# Altium schematic sheet 模型主控V1.SchDoc
size A1
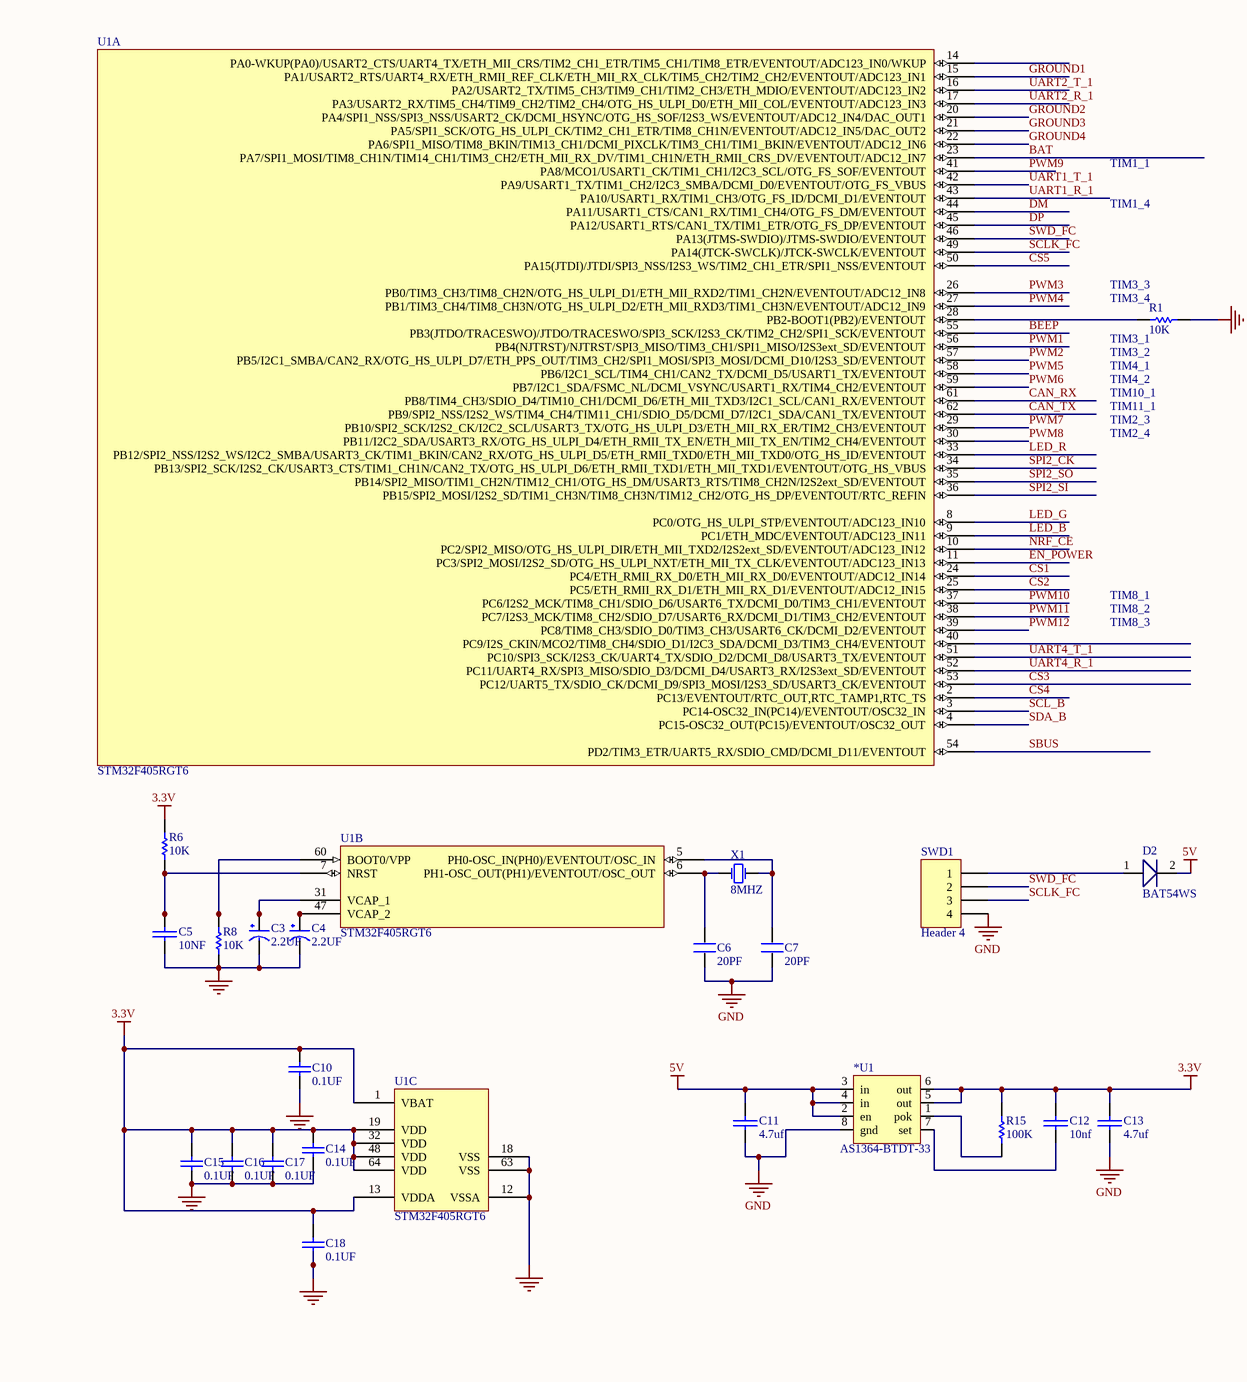
[diagram p0: 模型主控V1.SchDoc, top left]
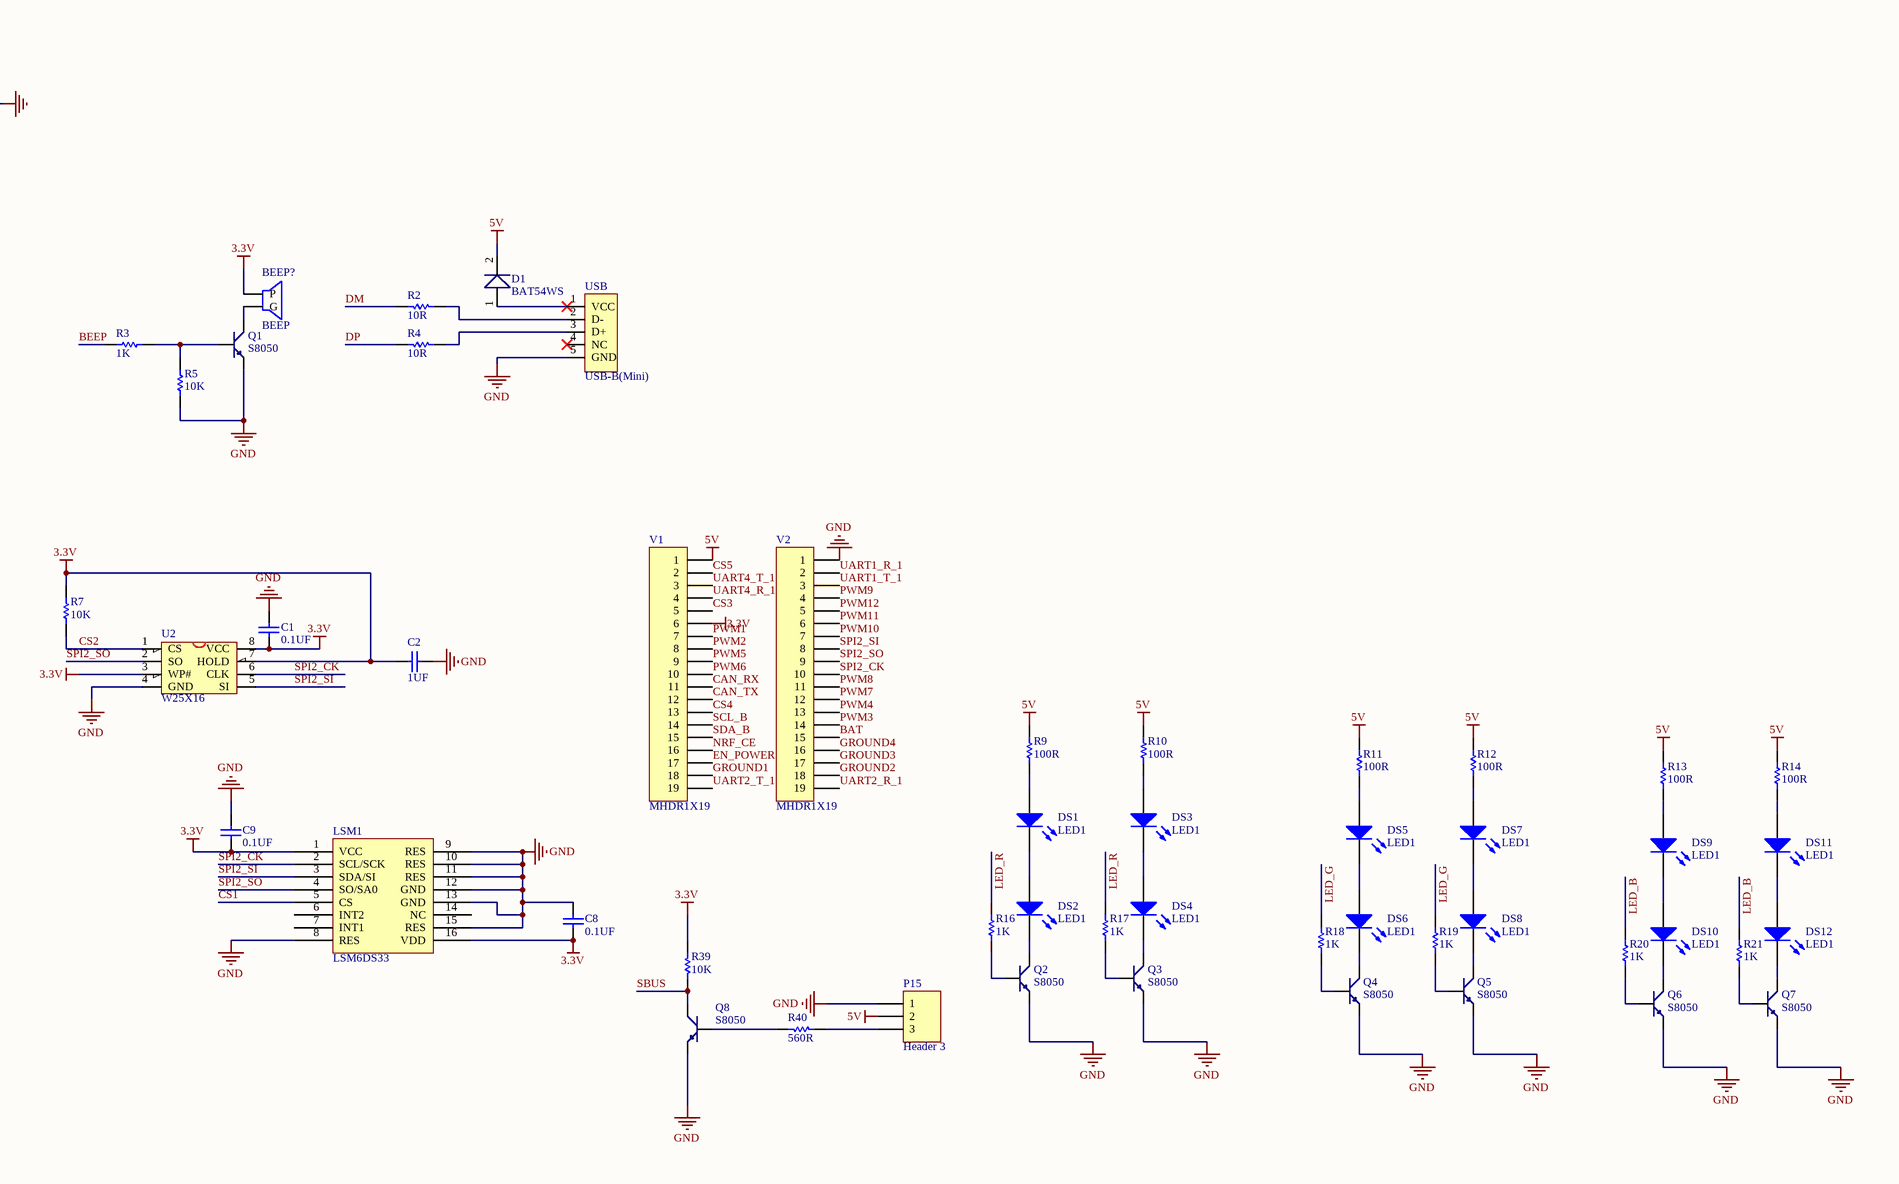
[diagram p1: 模型主控V1.SchDoc, top right]
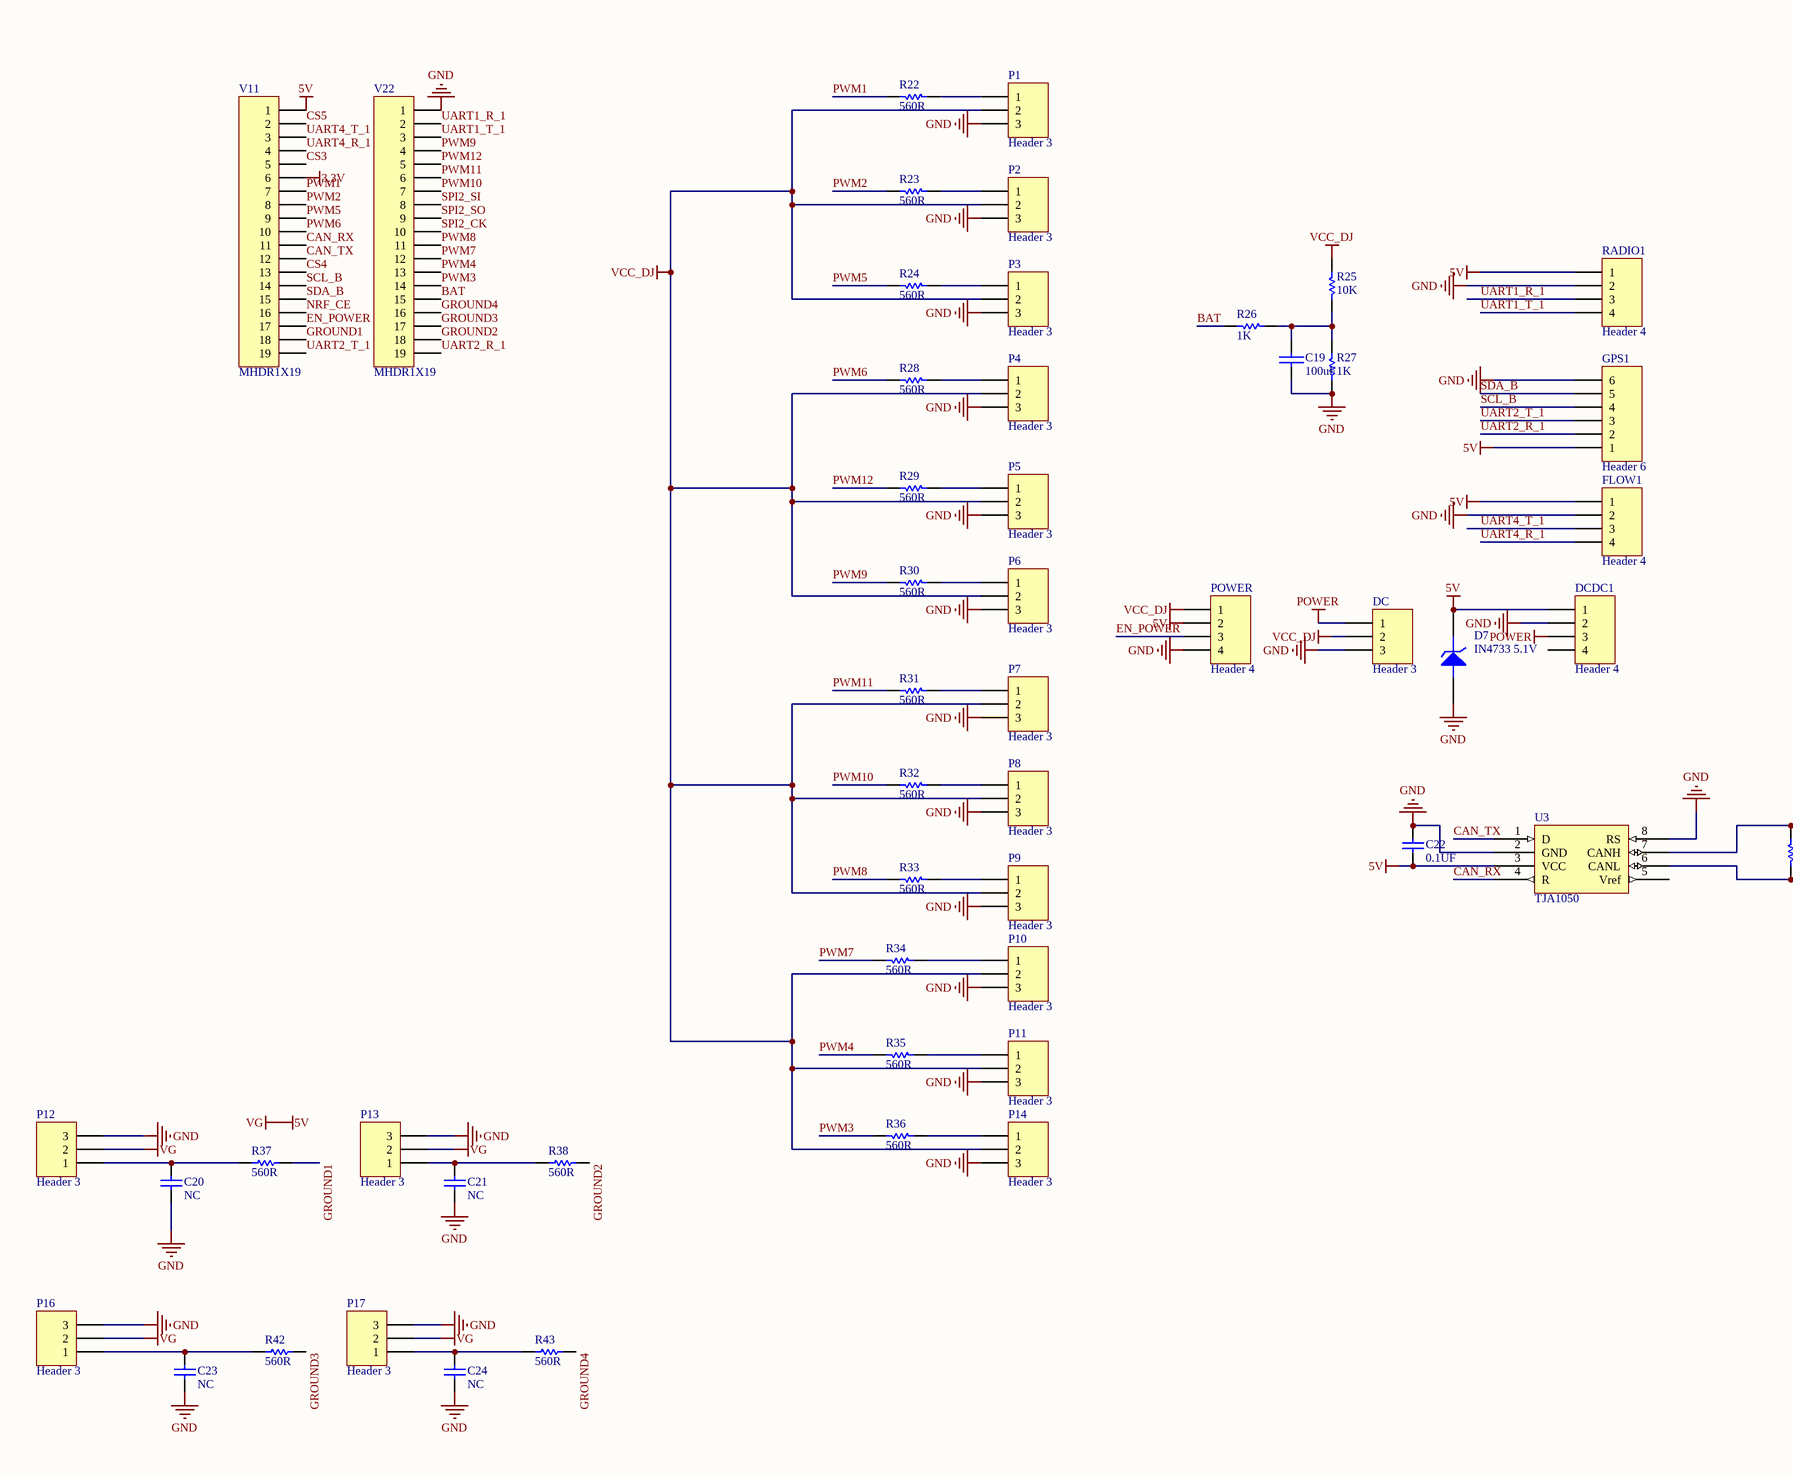
[diagram p2: 模型主控V1.SchDoc, bottom left]
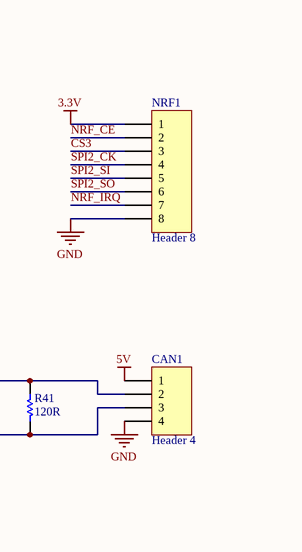
[diagram p3: 模型主控V1.SchDoc, bottom right]

## Parts
*U1  AS1364-BTDT-33  [TDFN-8]
BEEP?  BEEP  [DET402]
C1  0.1UF  [C 0402]
C2  1UF  [C 0402]
C3  2.2UF  [C0603]
C4  2.2UF  [C0603]
C5  10NF  [C 0402]
C6  20PF  [C 0402]
C7  20PF  [C 0402]
C8  0.1UF  [C0603]
C9  0.1UF  [C0603]
C10  0.1UF  [C 0402]
C11  4.7uf  [C0603]
C12  10nf  [C0603]
C13  4.7uf  [C0603]
C14  0.1UF  [C 0402]
C15  0.1UF  [C 0402]
C16  0.1UF  [C 0402]
C17  0.1UF  [C 0402]
C18  0.1UF  [C 0402]
C19  100uF  [C0603]
C20  NC  [C0603]
C21  NC  [C0603]
C22  0.1UF  [C 0402]
C23  NC  [C0603]
C24  NC  [C0603]
CAN1  Header 4  [PH2.0-4]
D1  BAT54WS  [SOD-323]
D2  BAT54WS  [SOD-323]
D7  IN4733 5.1V  [1n4148-SOD123]
DC  Header 3  [HDR1X3]
DCDC1  Header 4  [HDR1X4]
DS1  LED1  [0603_LED]
DS2  LED1  [0603_LED]
DS3  LED1  [0603_LED]
DS4  LED1  [0603_LED]
DS5  LED1  [0603_LED]
DS6  LED1  [0603_LED]
DS7  LED1  [0603_LED]
DS8  LED1  [0603_LED]
DS9  LED1  [0603_LED]
DS10  LED1  [0603_LED]
DS11  LED1  [0603_LED]
DS12  LED1  [0603_LED]
FLOW1  Header 4  [JST_GH_V4]
GPS1  Header 6  [JST_GH_V6]
LSM1  LSM6DS33  [LSM6DS33]
NRF1  Header 8  [NRF]
P1  Header 3  [HDR1X3]
P2  Header 3  [HDR1X3]
P3  Header 3  [HDR1X3]
P4  Header 3  [HDR1X3]
P5  Header 3  [HDR1X3]
P6  Header 3  [HDR1X3]
P7  Header 3  [HDR1X3]
P8  Header 3  [HDR1X3]
P9  Header 3  [HDR1X3]
P10  Header 3  [HDR1X3]
P11  Header 3  [HDR1X3]
P12  Header 3  [HDR1X3]
P13  Header 3  [HDR1X3]
P14  Header 3  [HDR1X3]
P15  Header 3  [HDR1X3]
P16  Header 3  [HDR1X3]
P17  Header 3  [HDR1X3]
POWER  Header 4  [JST_GH_V4]
Q1  S8050  [SOT-23R]
Q2  S8050  [SOT-23R]
Q3  S8050  [SOT-23R]
Q4  S8050  [SOT-23R]
Q5  S8050  [SOT-23R]
Q6  S8050  [SOT-23R]
Q7  S8050  [SOT-23R]
Q8  S8050  [SOT-23R]
R1  10K  [R 0402]
R2  10R  [R 0402]
R3  1K  [R0603]
R4  10R  [R 0402]
R5  10K  [R0603]
R6  10K  [R 0402]
R7  10K  [R 0402]
R8  10K  [R 0402]
R9  100R  [R 0402]
R10  100R  [R 0402]
R11  100R  [R 0402]
R12  100R  [R 0402]
R13  100R  [R 0402]
R14  100R  [R 0402]
R15  100K  [R0603]
R16  1K  [R 0402]
R17  1K  [R 0402]
R18  1K  [R 0402]
R19  1K  [R 0402]
R20  1K  [R 0402]
R21  1K  [R 0402]
R22  560R  [R 0402]
R23  560R  [R 0402]
R24  560R  [R 0402]
R25  10K  [R0603]
R26  1K  [R0603]
R27  1K  [R0603]
R28  560R  [R 0402]
R29  560R  [R 0402]
R30  560R  [R 0402]
R31  560R  [R 0402]
R32  560R  [R 0402]
R33  560R  [R 0402]
R34  560R  [R 0402]
R35  560R  [R 0402]
R36  560R  [R 0402]
R37  value 560R  [R0603]  (hidden comment: 1K)
R38  value 560R  [R0603]  (hidden comment: 1K)
R39  10K  [R 0402]
R40  560R  [R 0402]
R41  120R  [R0603]
R42  value 560R  [R0603]  (hidden comment: 1K)
R43  value 560R  [R0603]  (hidden comment: 1K)
RADIO1  Header 4  [JST_GH_V4]
SWD1  Header 4  [SH1.0-4P]
U1  STM32F405RGT6  [LQFP64_M]  (parts A,B,C of 3)
U2  W25X16  [W25Q32FVZPIG]
U3  TJA1050  [SOP-8]
USB  USB-B(Mini)  [Micro_USB]
V1  MHDR1X19  [MHDR1X19]
V2  MHDR1X19  [MHDR1X19]
V11  MHDR1X19  [MHDR1X19]
V22  MHDR1X19  [MHDR1X19]
X1  8MHZ  [PXCL]

## Nets
3.3V: *U1.5(out) *U1.6(out) BEEP?.1(P) C1.1 C2.2 C8.2 C9.2 C10.1 C12.1 C13.1 C14.1 C15.1 C16.1 C17.1 C18.1 LSM1.1(VCC) LSM1.16(VDD) NRF1.1 R6.2 R7.1 R15.1 R39.2 U1.1(VBAT) U1.13(VDDA) U1.19(VDD) U1.32(VDD) U1.48(VDD) U1.64(VDD) U2.3(WP#) U2.7(HOLD) U2.8(VCC) V1.6 V11.6
5V: *U1.2(en) *U1.3(in) *U1.4(in) C11.1 C22.2 CAN1.1 D1.2 D2.2 D7.2(K) DCDC1.1 FLOW1.1 GPS1.1 P12.2 P13.2 P15.2 P16.2 P17.2 POWER.2 R9.1 R10.1 R11.1 R12.1 R13.1 R14.1 RADIO1.1 U3.3(VCC) V1.1 V11.1  [also labelled VG]
GND: *U1.8(gnd) C1.2 C2.1 C3.2(GND) C4.2(GND) C5.1 C6.1 C7.1 C8.1 C9.1 C10.2 C11.2 C13.2 C14.2 C15.2 C16.2 C17.2 C18.2 C19.2 C20.2 C21.2 C22.1 C23.2 C24.2 CAN1.4 D7.1(A) DC.3 DCDC1.2 FLOW1.2 GPS1.6 LSM1.8(RES) LSM1.9(RES) LSM1.10(RES) LSM1.11(RES) LSM1.12(GND) LSM1.13(GND) LSM1.15(RES) NRF1.8 P1.3 P2.3 P3.3 P4.3 P5.3 P6.3 P7.3 P8.3 P9.3 P10.3 P11.3 P12.3 P13.3 P14.3 P15.1 P16.3 P17.3 POWER.4 Q1.1(E) Q2.1(E) Q3.1(E) Q4.1(E) Q5.1(E) Q6.1(E) Q7.1(E) Q8.1(E) R1.1 R5.1 R8.1 R27.1 RADIO1.2 SWD1.4 U1.12(VSSA) U1.18(VSS) U1.63(VSS) U2.4(GND) U3.2(GND) U3.8(RS) USB.5(GND) V2.1 V22.1
POWER: DC.1 DCDC1.3
VCC_DJ: DC.2 P1.2 P2.2 P3.2 P4.2 P5.2 P6.2 P7.2 P8.2 P9.2 P10.2 P11.2 P14.2 POWER.1 R25.2
BAT: R26.1 U1.23(PA7/SPI1_MOSI/TIM8_CH1N/TIM14_CH1/TIM3_CH2/ETH_MII_RX_DV/TIM1_CH1N/ETH_RMII_CRS_DV/EVENTOUT/ADC12_IN7) V2.15 V22.15
BEEP: R3.2 U1.55(PB3(JTDO/TRACESWO)/JTDO/TRACESWO/SPI3_SCK/I2S3_CK/TIM2_CH2/SPI1_SCK/EVENTOUT)
CAN_RX: U1.61(PB8/TIM4_CH3/SDIO_D4/TIM10_CH1/DCMI_D6/ETH_MII_TXD3/I2C1_SCL/CAN1_RX/EVENTOUT) U3.4(R) V1.11 V11.11
CAN_TX: U1.62(PB9/SPI2_NSS/I2S2_WS/TIM4_CH4/TIM11_CH1/SDIO_D5/DCMI_D7/I2C1_SDA/CAN1_TX/EVENTOUT) U3.1(D) V1.12 V11.12
CS1: LSM1.5(CS) U1.24(PC4/ETH_RMII_RX_D0/ETH_MII_RX_D0/EVENTOUT/ADC12_IN14)
CS2: R7.2 U1.25(PC5/ETH_RMII_RX_D1/ETH_MII_RX_D1/EVENTOUT/ADC12_IN15) U2.1(CS)
CS3: NRF1.3 U1.53(PC12/UART5_TX/SDIO_CK/DCMI_D9/SPI3_MOSI/I2S3_SD/USART3_CK/EVENTOUT) V1.5 V11.5
CS4: U1.2(PC13/EVENTOUT/RTC_OUT,RTC_TAMP1,RTC_TS) V1.13 V11.13
CS5: U1.50(PA15(JTDI)/JTDI/SPI3_NSS/I2S3_WS/TIM2_CH1_ETR/SPI1_NSS/EVENTOUT) V1.2 V11.2
DM: R2.1 U1.44(PA11/USART1_CTS/CAN1_RX/TIM1_CH4/OTG_FS_DM/EVENTOUT)
DP: R4.1 U1.45(PA12/USART1_RTS/CAN1_TX/TIM1_ETR/OTG_FS_DP/EVENTOUT)
EN_POWER: POWER.3 U1.11(PC3/SPI2_MOSI/I2S2_SD/OTG_HS_ULPI_NXT/ETH_MII_TX_CLK/EVENTOUT/ADC123_IN13) V1.17 V11.17
GROUND1: R37.2 U1.15(PA1/USART2_RTS/UART4_RX/ETH_RMII_REF_CLK/ETH_MII_RX_CLK/TIM5_CH2/TIM2_CH2/EVENTOUT/ADC123_IN1) V1.18 V11.18
GROUND2: R38.2 U1.20(PA4/SPI1_NSS/SPI3_NSS/USART2_CK/DCMI_HSYNC/OTG_HS_SOF/I2S3_WS/EVENTOUT/ADC12_IN4/DAC_OUT1) V2.18 V22.18
GROUND3: R42.2 U1.21(PA5/SPI1_SCK/OTG_HS_ULPI_CK/TIM2_CH1_ETR/TIM8_CH1N/EVENTOUT/ADC12_IN5/DAC_OUT2) V2.17 V22.17
GROUND4: R43.2 U1.22(PA6/SPI1_MISO/TIM8_BKIN/TIM13_CH1/DCMI_PIXCLK/TIM3_CH1/TIM1_BKIN/EVENTOUT/ADC12_IN6) V2.16 V22.16
LED_B: R20.1 R21.1 U1.9(PC1/ETH_MDC/EVENTOUT/ADC123_IN11)
LED_G: R18.1 R19.1 U1.8(PC0/OTG_HS_ULPI_STP/EVENTOUT/ADC123_IN10)
LED_R: R16.1 R17.1 U1.33(PB12/SPI2_NSS/I2S2_WS/I2C2_SMBA/USART3_CK/TIM1_BKIN/CAN2_RX/OTG_HS_ULPI_D5/ETH_RMII_TXD0/ETH_MII_TXD0/OTG_HS_ID/EVENTOUT)
NRF_CE: NRF1.2 U1.10(PC2/SPI2_MISO/OTG_HS_ULPI_DIR/ETH_MII_TXD2/I2S2ext_SD/EVENTOUT/ADC123_IN12) V1.16 V11.16
NRF_IRQ: NRF1.7
PWM1: R22.1 U1.56(PB4(NJTRST)/NJTRST/SPI3_MISO/TIM3_CH1/SPI1_MISO/I2S3ext_SD/EVENTOUT) V1.7 V11.7
PWM2: R23.1 U1.57(PB5/I2C1_SMBA/CAN2_RX/OTG_HS_ULPI_D7/ETH_PPS_OUT/TIM3_CH2/SPI1_MOSI/SPI3_MOSI/DCMI_D10/I2S3_SD/EVENTOUT) V1.8 V11.8
PWM3: R36.1 U1.26(PB0/TIM3_CH3/TIM8_CH2N/OTG_HS_ULPI_D1/ETH_MII_RXD2/TIM1_CH2N/EVENTOUT/ADC12_IN8) V2.14 V22.14
PWM4: R35.1 U1.27(PB1/TIM3_CH4/TIM8_CH3N/OTG_HS_ULPI_D2/ETH_MII_RXD3/TIM1_CH3N/EVENTOUT/ADC12_IN9) V2.13 V22.13
PWM5: R24.1 U1.58(PB6/I2C1_SCL/TIM4_CH1/CAN2_TX/DCMI_D5/USART1_TX/EVENTOUT) V1.9 V11.9
PWM6: R28.1 U1.59(PB7/I2C1_SDA/FSMC_NL/DCMI_VSYNC/USART1_RX/TIM4_CH2/EVENTOUT) V1.10 V11.10
PWM7: R34.1 U1.29(PB10/SPI2_SCK/I2S2_CK/I2C2_SCL/USART3_TX/OTG_HS_ULPI_D3/ETH_MII_RX_ER/TIM2_CH3/EVENTOUT) V2.12 V22.12
PWM8: R33.1 U1.30(PB11/I2C2_SDA/USART3_RX/OTG_HS_ULPI_D4/ETH_RMII_TX_EN/ETH_MII_TX_EN/TIM2_CH4/EVENTOUT) V2.11 V22.11
PWM9: R30.1 U1.41(PA8/MCO1/USART1_CK/TIM1_CH1/I2C3_SCL/OTG_FS_SOF/EVENTOUT) V2.4 V22.4
PWM10: R32.1 U1.37(PC6/I2S2_MCK/TIM8_CH1/SDIO_D6/USART6_TX/DCMI_D0/TIM3_CH1/EVENTOUT) V2.7 V22.7
PWM11: R31.1 U1.38(PC7/I2S3_MCK/TIM8_CH2/SDIO_D7/USART6_RX/DCMI_D1/TIM3_CH2/EVENTOUT) V2.6 V22.6
PWM12: R29.1 U1.39(PC8/TIM8_CH3/SDIO_D0/TIM3_CH3/USART6_CK/DCMI_D2/EVENTOUT) V2.5 V22.5
SBUS: Q8.3(C) R39.1 U1.54(PD2/TIM3_ETR/UART5_RX/SDIO_CMD/DCMI_D11/EVENTOUT)
SCL_B: GPS1.4 U1.3(PC14-OSC32_IN(PC14)/EVENTOUT/OSC32_IN) V1.14 V11.14
SCLK_FC: SWD1.3 U1.49(PA14(JTCK-SWCLK)/JTCK-SWCLK/EVENTOUT)
SDA_B: GPS1.5 U1.4(PC15-OSC32_OUT(PC15)/EVENTOUT/OSC32_OUT) V1.15 V11.15
SPI2_CK: LSM1.2(SCL/SCK) NRF1.4 U1.34(PB13/SPI2_SCK/I2S2_CK/USART3_CTS/TIM1_CH1N/CAN2_TX/OTG_HS_ULPI_D6/ETH_RMII_TXD1/ETH_MII_TXD1/EVENTOUT/OTG_HS_VBUS) U2.6(CLK) V2.10 V22.10
SPI2_SI: LSM1.3(SDA/SI) NRF1.5 U1.36(PB15/SPI2_MOSI/I2S2_SD/TIM1_CH3N/TIM8_CH3N/TIM12_CH2/OTG_HS_DP/EVENTOUT/RTC_REFIN) U2.5(SI) V2.8 V22.8
SPI2_SO: LSM1.4(SO/SA0) NRF1.6 U1.35(PB14/SPI2_MISO/TIM1_CH2N/TIM12_CH1/OTG_HS_DM/USART3_RTS/TIM8_CH2N/I2S2ext_SD/EVENTOUT) U2.2(SO) V2.9 V22.9
SWD_FC: SWD1.2 U1.46(PA13(JTMS-SWDIO)/JTMS-SWDIO/EVENTOUT)
UART1_R_1: RADIO1.3 U1.43(PA10/USART1_RX/TIM1_CH3/OTG_FS_ID/DCMI_D1/EVENTOUT) V2.2 V22.2
UART1_T_1: RADIO1.4 U1.42(PA9/USART1_TX/TIM1_CH2/I2C3_SMBA/DCMI_D0/EVENTOUT/OTG_FS_VBUS) V2.3 V22.3
UART2_R_1: GPS1.2 U1.17(PA3/USART2_RX/TIM5_CH4/TIM9_CH2/TIM2_CH4/OTG_HS_ULPI_D0/ETH_MII_COL/EVENTOUT/ADC123_IN3) V2.19 V22.19
UART2_T_1: GPS1.3 U1.16(PA2/USART2_TX/TIM5_CH3/TIM9_CH1/TIM2_CH3/ETH_MDIO/EVENTOUT/ADC123_IN2) V1.19 V11.19
UART4_R_1: FLOW1.4 U1.52(PC11/UART4_RX/SPI3_MISO/SDIO_D3/DCMI_D4/USART3_RX/I2S3ext_SD/EVENTOUT) V1.4 V11.4
UART4_T_1: FLOW1.3 U1.51(PC10/SPI3_SCK/I2S3_CK/UART4_TX/SDIO_D2/DCMI_D8/USART3_TX/EVENTOUT) V1.3 V11.3
Net*U1_1: *U1.1(pok) R15.2
Net*U1_7: *U1.7(set) C12.2
NetBEEP?_2: BEEP?.2(G) Q1.3(C)
NetC3_1: C3.1(VCC) U1.31(VCAP_1)
NetC4_1: C4.1(VCC) U1.47(VCAP_2)
NetC5_2: C5.2 R6.1 U1.7(NRST)
NetC6_2: C6.2 U1.6(PH1-OSC_OUT(PH1)/EVENTOUT/OSC_OUT) X1.1(OSC1)
NetC7_2: C7.2 U1.5(PH0-OSC_IN(PH0)/EVENTOUT/OSC_IN) X1.2(OSC2)
NetC19_1: C19.1 R25.1 R26.2 R27.2
NetC20_1: C20.1 P12.1 R37.1
NetC21_1: C21.1 P13.1 R38.1
NetC23_1: C23.1 P16.1 R42.1
NetC24_1: C24.1 P17.1 R43.1
NetCAN1_2: CAN1.2 R41.2 U3.7(CANH)
NetCAN1_3: CAN1.3 R41.1 U3.6(CANL)
NetD1_1: D1.1 USB.1(VCC)
NetD2_1: D2.1 SWD1.1
NetDS1_1: DS1.1(A) R9.2
NetDS1_2: DS1.2(K) DS2.1(A)
NetDS2_2: DS2.2(K) Q2.3(C)
NetDS3_1: DS3.1(A) R10.2
NetDS3_2: DS3.2(K) DS4.1(A)
NetDS4_2: DS4.2(K) Q3.3(C)
NetDS5_1: DS5.1(A) R11.2
NetDS5_2: DS5.2(K) DS6.1(A)
NetDS6_2: DS6.2(K) Q4.3(C)
NetDS7_1: DS7.1(A) R12.2
NetDS7_2: DS7.2(K) DS8.1(A)
NetDS8_2: DS8.2(K) Q5.3(C)
NetDS9_1: DS9.1(A) R13.2
NetDS9_2: DS9.2(K) DS10.1(A)
NetDS10_2: DS10.2(K) Q6.3(C)
NetDS11_1: DS11.1(A) R14.2
NetDS11_2: DS11.2(K) DS12.1(A)
NetDS12_2: DS12.2(K) Q7.3(C)
NetP1_1: P1.1 R22.2
NetP2_1: P2.1 R23.2
NetP3_1: P3.1 R24.2
NetP4_1: P4.1 R28.2
NetP5_1: P5.1 R29.2
NetP6_1: P6.1 R30.2
NetP7_1: P7.1 R31.2
NetP8_1: P8.1 R32.2
NetP9_1: P9.1 R33.2
NetP10_1: P10.1 R34.2
NetP11_1: P11.1 R35.2
NetP14_1: P14.1 R36.2
NetP15_3: P15.3 R40.2
NetQ1_2: Q1.2(B) R3.1 R5.2
NetQ2_2: Q2.2(B) R16.2
NetQ3_2: Q3.2(B) R17.2
NetQ4_2: Q4.2(B) R18.2
NetQ5_2: Q5.2(B) R19.2
NetQ6_2: Q6.2(B) R20.2
NetQ7_2: Q7.2(B) R21.2
NetQ8_2: Q8.2(B) R40.1
NetR1_2: R1.2 U1.28(PB2-BOOT1(PB2)/EVENTOUT)
NetR2_2: R2.2 USB.2(D-)
NetR4_2: R4.2 USB.3(D+)
NetR8_2: R8.2 U1.60(BOOT0/VPP)

Not connected (* = marked no-connect by the designer): DCDC1 4; LSM1 6(INT2) 7(INT1) 14(NC); U1 14(PA0-WKUP(PA0)/USART2_CTS/UART4_TX/ETH_MII_CRS/TIM2_CH1_ETR/TIM5_CH1/TIM8_ETR/EVENTOUT/ADC123_IN0/WKUP) 40(PC9/I2S_CKIN/MCO2/TIM8_CH4/SDIO_D1/I2C3_SDA/DCMI_D3/TIM3_CH4/EVENTOUT); U3 5(Vref); USB 4(NC)*

## Notes on the sheet
- TIM1_1
- TIM1_4
- (near R1) TIM3_3
- (near R1) TIM3_4
- (near R1) TIM3_1
- (near R1) TIM3_2
- (near R1) TIM4_1
- TIM4_2
- TIM10_1
- TIM11_1
- TIM2_3
- TIM2_4
- TIM8_1
- TIM8_2
- TIM8_3

## Library data of the parts
*U1 = AS1364-3.3V
C1 C2 C8-C10 C14-C18 C20-C24 = CAP: Capacitor; Value: 100nF; Published: 8-Jun-2000; Revision: July-2002: Re-released for DXP Platform.; Publisher: Altium Limited
C3 C4 = CAP1: 胆电容
C5 C11-C13 C19 = CAP: Capacitor
C6 C7 = C2: 0805
CAN1 DCDC1 FLOW1 POWER RADIO1 SWD1 = Header 4: Header, 4-Pin; LatestRevisionDate: 17-Jul-2002; LatestRevisionNote: Re-released for DXP Platform.; Publisher: Altium Limited
D1 D2 = BAT54: 单肖特基二极管
D7 = ZENER3: Zener Diode
DC P1-P17 = Header 3: Header, 3-Pin; LatestRevisionDate: 17-Jul-2002; LatestRevisionNote: Re-released for DXP Platform.; Publisher: Altium Limited
DS1-DS12 = LED2: Typical RED, GREEN, YELLOW, AMBER GaAs LED; Published: 8-Jun-2000; LatestRevisionDate: 17-Jul-2002; LatestRevisionNote: Re-released for DXP Platform.; PackageDocument: Feb-2002; PackageReference: 3.2X1.6X1.1; Publisher: Altium Limited
GPS1 = Header 6: Header, 6-Pin; LatestRevisionDate: 17-Jul-2002; LatestRevisionNote: Re-released for DXP Platform.; Publisher: Altium Limited
NRF1 = Header 8: Header, 8-Pin; LatestRevisionDate: 17-Jul-2002; LatestRevisionNote: Re-released for DXP Platform.; Publisher: Altium Limited
Q1-Q8 = NPN: 8050/BCW846/BCW847
R1-R14 R16-R36 R39-R41 = Res2: 0603
R15 R37 R38 R42 R43 = Res1: Resistor; Published: 8-Jun-2000; Revision: July-2002: Re-released for DXP Platform.; Publisher: Altium Limited
  R15: Value: 100K
U2 = W25X16: W25X16;SST25VF016;MX25L1605
U3 = SN65HVD230D
USB = USB5
V1 V2 V11 V22 = MHDR1X19: Header, 19-Pin; LatestRevisionDate: 17-Jul-2002; LatestRevisionNote: Re-released for DXP Platform.; Publisher: Altium Limited
X1 = XTAL: Crystal Oscillator; Published: 8-Jun-2000; LatestRevisionDate: 17-Jul-2002; LatestRevisionNote: Re-released for DXP Platform.; Publisher: Altium Limited